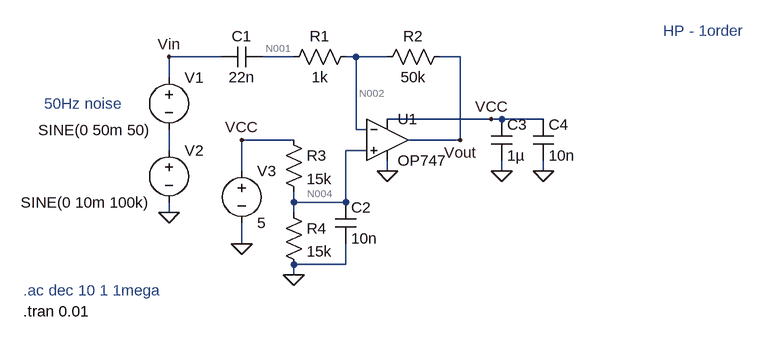
[diagram p0: schematic Draft1.asc]
Draft1.asc, the LTspice schematic file:
Version 4.1
SHEET 1 896 680
WIRE 80 32 0 32
WIRE 192 32 144 32
WIRE 288 32 272 32
WIRE 336 32 288 32
WIRE 448 32 416 32
WIRE 0 64 0 32
WIRE 496 128 336 128
WIRE 512 128 496 128
WIRE 576 128 512 128
WIRE 288 144 288 32
WIRE 304 144 288 144
WIRE 192 160 112 160
WIRE 448 160 448 32
WIRE 448 160 368 160
WIRE 0 176 0 144
WIRE 304 176 272 176
WIRE 112 208 112 160
WIRE 336 208 336 192
WIRE 512 208 512 192
WIRE 576 208 576 192
WIRE 192 256 192 240
WIRE 272 256 272 176
WIRE 272 256 192 256
WIRE 0 272 0 256
WIRE 192 272 192 256
WIRE 112 320 112 288
WIRE 272 352 272 320
WIRE 272 352 192 352
WIRE 192 368 192 352
FLAG 0 272 0
FLAG 336 208 0
FLAG 112 320 0
FLAG 112 160 VCC
FLAG 192 368 0
FLAG 512 208 0
FLAG 576 208 0
FLAG 496 128 VCC
FLAG 0 32 Vin
FLAG 448 160 Vout
SYMBOL voltage 0 48 R0
WINDOW 3 -201 97 Left 2
WINDOW 123 0 0 Left 0
WINDOW 39 0 0 Left 0
SYMATTR Value SINE(0 50m 50)
SYMATTR InstName V1
SYMBOL voltage 0 160 R0
WINDOW 3 -228 96 Left 2
WINDOW 123 0 0 Left 0
WINDOW 39 0 0 Left 0
SYMATTR Value SINE(0 10m 100k)
SYMATTR InstName V2
SYMBOL cap 144 16 R90
WINDOW 0 0 32 VBottom 2
WINDOW 3 32 32 VTop 2
SYMATTR InstName C1
SYMATTR Value 22n
SYMBOL res 288 16 R90
WINDOW 0 0 56 VBottom 2
WINDOW 3 32 56 VTop 2
SYMATTR InstName R1
SYMATTR Value 1k
SYMBOL res 432 16 R90
WINDOW 0 0 56 VBottom 2
WINDOW 3 32 56 VTop 2
SYMATTR InstName R2
SYMATTR Value 50k
SYMBOL cap 256 256 R0
SYMATTR InstName C2
SYMATTR Value 10n
SYMBOL res 176 144 R0
SYMATTR InstName R3
SYMATTR Value 15k
SYMBOL res 176 256 R0
SYMATTR InstName R4
SYMATTR Value 15k
SYMBOL voltage 112 192 R0
WINDOW 123 0 0 Left 0
WINDOW 39 0 0 Left 0
SYMATTR InstName V3
SYMATTR Value 5
SYMBOL cap 496 128 R0
SYMATTR InstName C3
SYMATTR Value 1µ
SYMBOL cap 560 128 R0
SYMATTR InstName C4
SYMATTR Value 10n
SYMBOL OpAmps\\OP747 336 96 R0
SYMATTR InstName U1
TEXT -192 104 Left 2 ;50Hz noise
TEXT -224 392 Left 2 ;.ac dec 10 1 1mega
TEXT 760 -8 Left 2 ;HP - 1order
TEXT -224 424 Left 2 !.tran 0.01

The netlist it stands for:
* Draft1.asc
V1 Vin N003 SINE(0 50m 50)
V2 N003 0 SINE(0 10m 100k)
C1 N001 Vin 22n
R1 N002 N001 1k
R2 Vout N002 50k
C2 N004 0 10n
R3 VCC N004 15k
R4 N004 0 15k
V3 VCC 0 5
C3 VCC 0 1µ
C4 VCC 0 10n
X§U1 N004 N002 VCC 0 Vout OP747  ; pins In+ In- V+ V- OUT
* 50Hz noise
* .ac dec 10 1 1mega
* HP - 1order
.tran 0.01
.backanno
.end

* Results of the author's LTspice run, read from the files saved beside the schematic
* Operating Point, zero values left out:
*   V(n002) = 2.5 V
*   V(vout) = 2.5 V
*   V(vcc) = 5 V
*   V(n001) = 2.5 V
*   V(n004) = 2.5 V
*   I(R2) = -9.801 nA
*   I(R4) = 166.7 µA
*   I(R3) = 166.7 µA
*   I(V3) = -383.4 µA
*   Ix(u1:1) = -11.8 nA
*   Ix(u1:2) = -9.801 nA
*   Ix(u1:99) = 216.8 µA
*   Ix(u1:50) = -216.8 µA
*   Ix(u1:45) = 9.801 nA
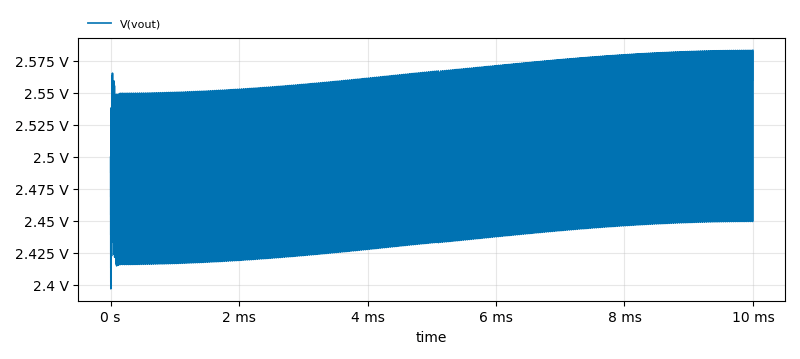
[diagram p1: Transient Analysis of Draft1.asc, plotted from the saved traces]
* Transient Analysis, 1 run:
*   V(vout): min 2.389 V, max 2.584 V, average 2.5 V, rms 2.5 V, last 2.584 V